# EAGLE schematic Pacman (EAGLE 9.2.2)
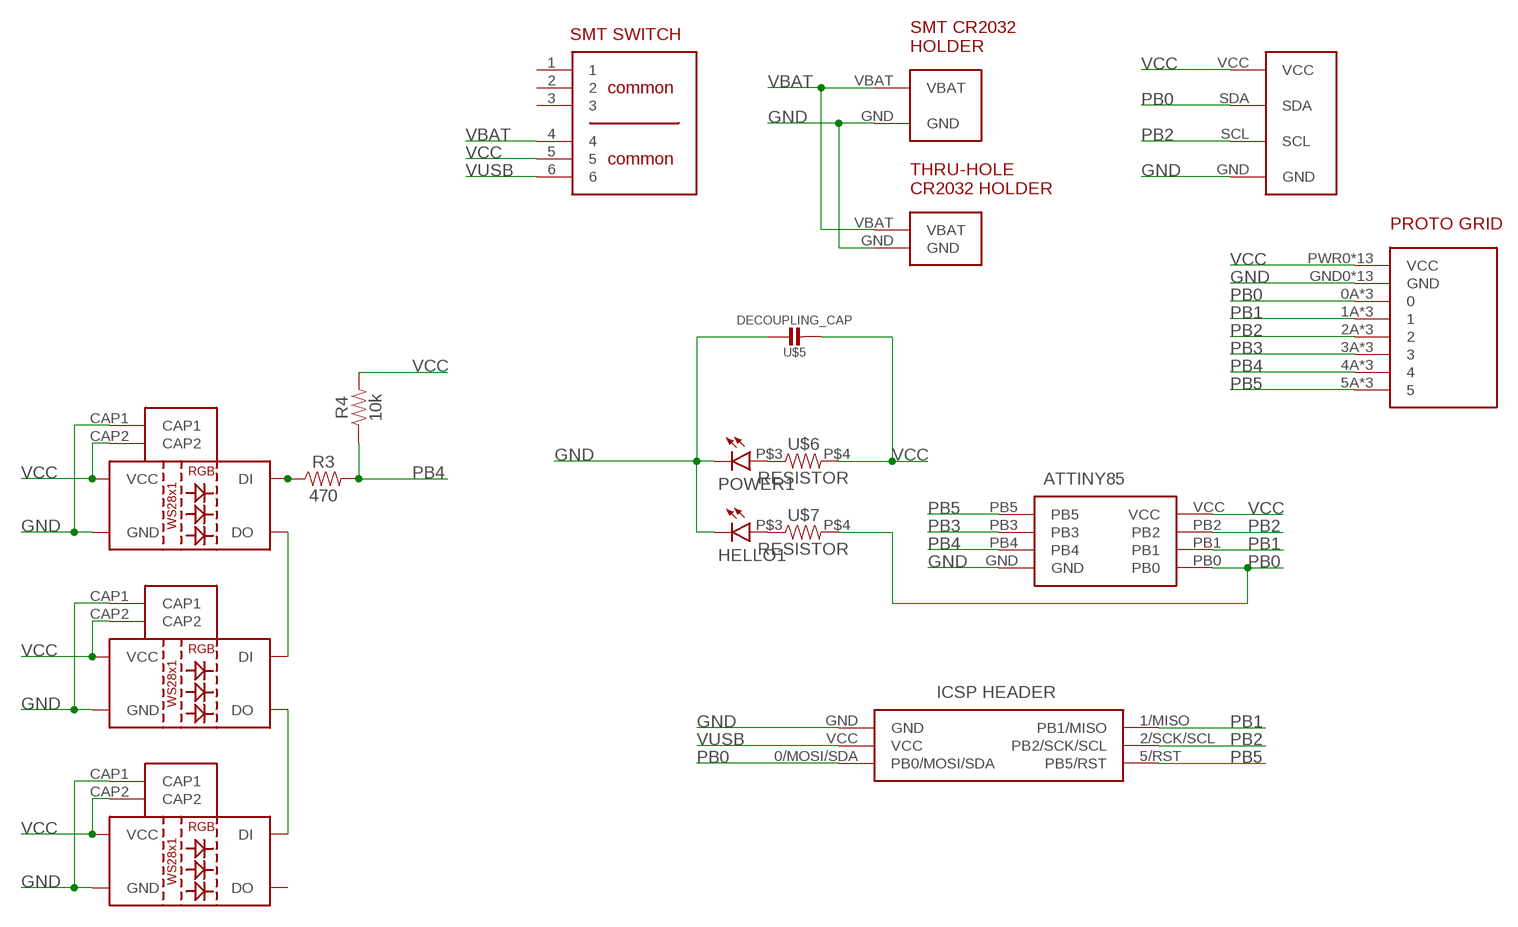
[diagram p0: schematic, sheet 1]

## Parts
D4  WS2812B  [WS2812B]
D5  WS2812B  [WS2812B]
D6  WS2812B  [WS2812B]
HELLO1  LED3MM  [LED3MM]
IC2  ATTINY85-20SU  [SOT127P798X216-8N]
J2  M20-9980346  [HDRV6W64P254_2X3_762X508X868P]
POWER1  LED3MM  [LED3MM]
R3  470  470OHM-0603-1/10W-1%  [0603]
R4  10k  10KOHM-0603-1/10W-1%  [0603]
U$5  DECOUPLING_CAP  [DECOUPLING_CAP]
U$6  RESISTOR  [AXIAL-0.3]
U$7  RESISTOR  [AXIAL-0.3]
U$8  SMT-SWITCH  [SMT-SWITCH]
U$9  PROTO  [PROTO]
U$10  SMT-BATTERY-HOLDER  [SMT-CR-HOLDER]
U$11  THRU-CR-HOLDER  [THRU-CR-HOLDER]
U$12  I2C-PADS  [I2C-PADS]

## Nets
GND [GND]: D4.CAP1 D4.GND D5.CAP1 D5.GND D6.CAP1 D6.GND HELLO1.NEG IC2.GND J2.GND POWER1.NEG U$5.P$1 U$9.GND0(GND) U$9.GND1(GND) U$9.GND2(GND) U$9.GND3(GND) U$9.GND4(GND) U$9.GND5(GND) U$9.GND6(GND) U$9.GND7(GND) U$9.GND8(GND) U$9.GND9(GND) U$9.GND10(GND) U$9.GND11(GND) U$9.GND12(GND) U$10.GND U$11.GND U$12.GND
N$6: POWER1.POS U$6.P$3
N$7: HELLO1.POS U$7.P$3
N$8: D4.DO D5.DI
N$9: D5.DO D6.DI
N$10: D4.DI R3.1
PB0: IC2.PB0 J2.0/MOSI/SDA(PB0/MOSI/SDA) U$7.P$4 U$9.0A U$9.0B U$9.0C U$12.SDA
PB1: IC2.PB1 J2.1/MISO(PB1/MISO) U$9.1A U$9.1B U$9.1C
PB2: IC2.PB2 J2.2/SCK/SCL(PB2/SCK/SCL) U$9.2A U$9.2B U$9.2C U$12.SCL
PB3: IC2.PB3 U$9.3A U$9.3B U$9.3C
PB4: IC2.PB4 R3.2 R4.1 U$9.4A U$9.4B U$9.4C
PB5: IC2.PB5 J2.5/RST(PB5/RST) U$9.5A U$9.5B U$9.5C
VBAT [VBAT]: U$8.4 U$10.VBAT U$11.VBAT
VCC [VCC]: D4.CAP2 D4.VCC D5.CAP2 D5.VCC D6.CAP2 D6.VCC IC2.VCC R4.2 U$5.P$2 U$6.P$4 U$8.5 U$9.PWR0(VCC) U$9.PWR1(VCC) U$9.PWR2(VCC) U$9.PWR3(VCC) U$9.PWR4(VCC) U$9.PWR5(VCC) U$9.PWR6(VCC) U$9.PWR7(VCC) U$9.PWR8(VCC) U$9.PWR9(VCC) U$9.PWR10(VCC) U$9.PWR11(VCC) U$9.PWR12(VCC) U$12.VCC
VUSB: J2.VCC U$8.6
Unconnected: D6.DO U$8.1 U$8.2 U$8.3

## Library data of the parts
D4-D6 = BadgeParts:WS2812B: WS2812B SMD addressable RGB LED 5x5mm SMD LED with built-in controller IC. Color: Red/Green/Blue mC Rating: RGB: 390, 660, 180 mcd Forward Voltage: RGB: 2.0, 3.0, 3.0 V Packages:WS2812B SparkFun Products: Blynk Board - ESP8266 <https://www.sparkfun.com/products/13794>; PROD_ID: DIO-12503
HELLO1 POWER1 = BadgeParts:LED3MM
IC2 = BadgeParts:ATTINY85-20SU: MICROCHIP - ATTINY85-20SU - MICROCONTROLLER MCU, 8 BIT, ATTINY, 20MHZ, SOIC-8 Source: Datasheet <https://componentsearchengine.com/Datasheets/2/ATTINY85-20SU.pdf>; ARROW_PART_NUMBER: ATTINY85-20SU; ARROW_PRICE/STOCK: https://www.arrow.com/en/products/attiny85-20su/microchip-technology; DESCRIPTION: MICROCHIP - ATTINY85-20SU - MICROCONTROLLER MCU, 8 BIT, ATTINY, 20MHZ, SOIC-8; HEIGHT: 2.16mm; MANUFACTURER_NAME: Microchip; MANUFACTURER_PART_NUMBER: ATTINY85-20SU; RS_PART_NUMBER: 1331674; RS_PRICE/STOCK: http://uk.rs-online.com/web/p/products/1331674
J2 = BadgeParts:M20-9980346: 03+03 DIL Vertical Pin Header HARWIN M20 Series, 2.54mm Pitch 6 Way 2 Row Straight PCB Header, Solder Termination, 3A Source: Datasheet <https://cdn.harwin.com/pdfs/M20-998.pdf?utm_source=3D_PDF&utm_medium=3D_PDF&utm_campaign=3D_PDF>; ARROW_PART_NUMBER: M20-9980346; ARROW_PRICE/STOCK: http://uk.rs-online.com/web/p/products/7457046P; DESCRIPTION: 03+03 DIL Vertical Pin Header HARWIN M20 Series, 2.54mm Pitch 6 Way 2 Row Straight PCB Header, Solder Termination, 3A; HEIGHT: 8.68mm; MANUFACTURER_NAME: HARWIN; MANUFACTURER_PART_NUMBER: M20-9980346; RS_PART_NUMBER: 7457046P; RS_PRICE/STOCK: http://uk.rs-online.com/web/p/products/7457046P
R3 = SparkFun-Resistors:470OHM: 470Ω resistor A resistor is a passive two-terminal electrical component that implements electrical resistance as a circuit element. Resistors act to reduce current flow, and, at the same time, act to lower voltage levels within circuits. - Wikipedia; PROD_ID: RES-07869
R4 = SparkFun-Resistors:10KOHM: 10kΩ resistor A resistor is a passive two-terminal electrical component that implements electrical resistance as a circuit element. Resistors act to reduce current flow, and, at the same time, act to lower voltage levels within circuits. - Wikipedia; PROD_ID: RES-00824
U$5 = BadgeParts:DECOUPLING_CAP
U$6 U$7 = BadgeParts:RESISTOR
U$8 = BadgeParts:SMT-SWITCH
U$9 = BadgeParts:PROTO
U$10 = BadgeParts:SMT-BATTERY-HOLDER
U$11 = BadgeParts:THRU-CR-HOLDER
U$12 = BadgeParts:I2C-PADS

## Net classes
0 default: width 0.254 mm, clearance 0.254 mm
1 VCC: width 0.381 mm, clearance 0.254 mm
2 GND: width 0.381 mm, clearance 0.254 mm
3 VBAT: width 0.381 mm, clearance 0.254 mm